# Altium schematic sheet 10.SchDoc
size 297 x 209 mm
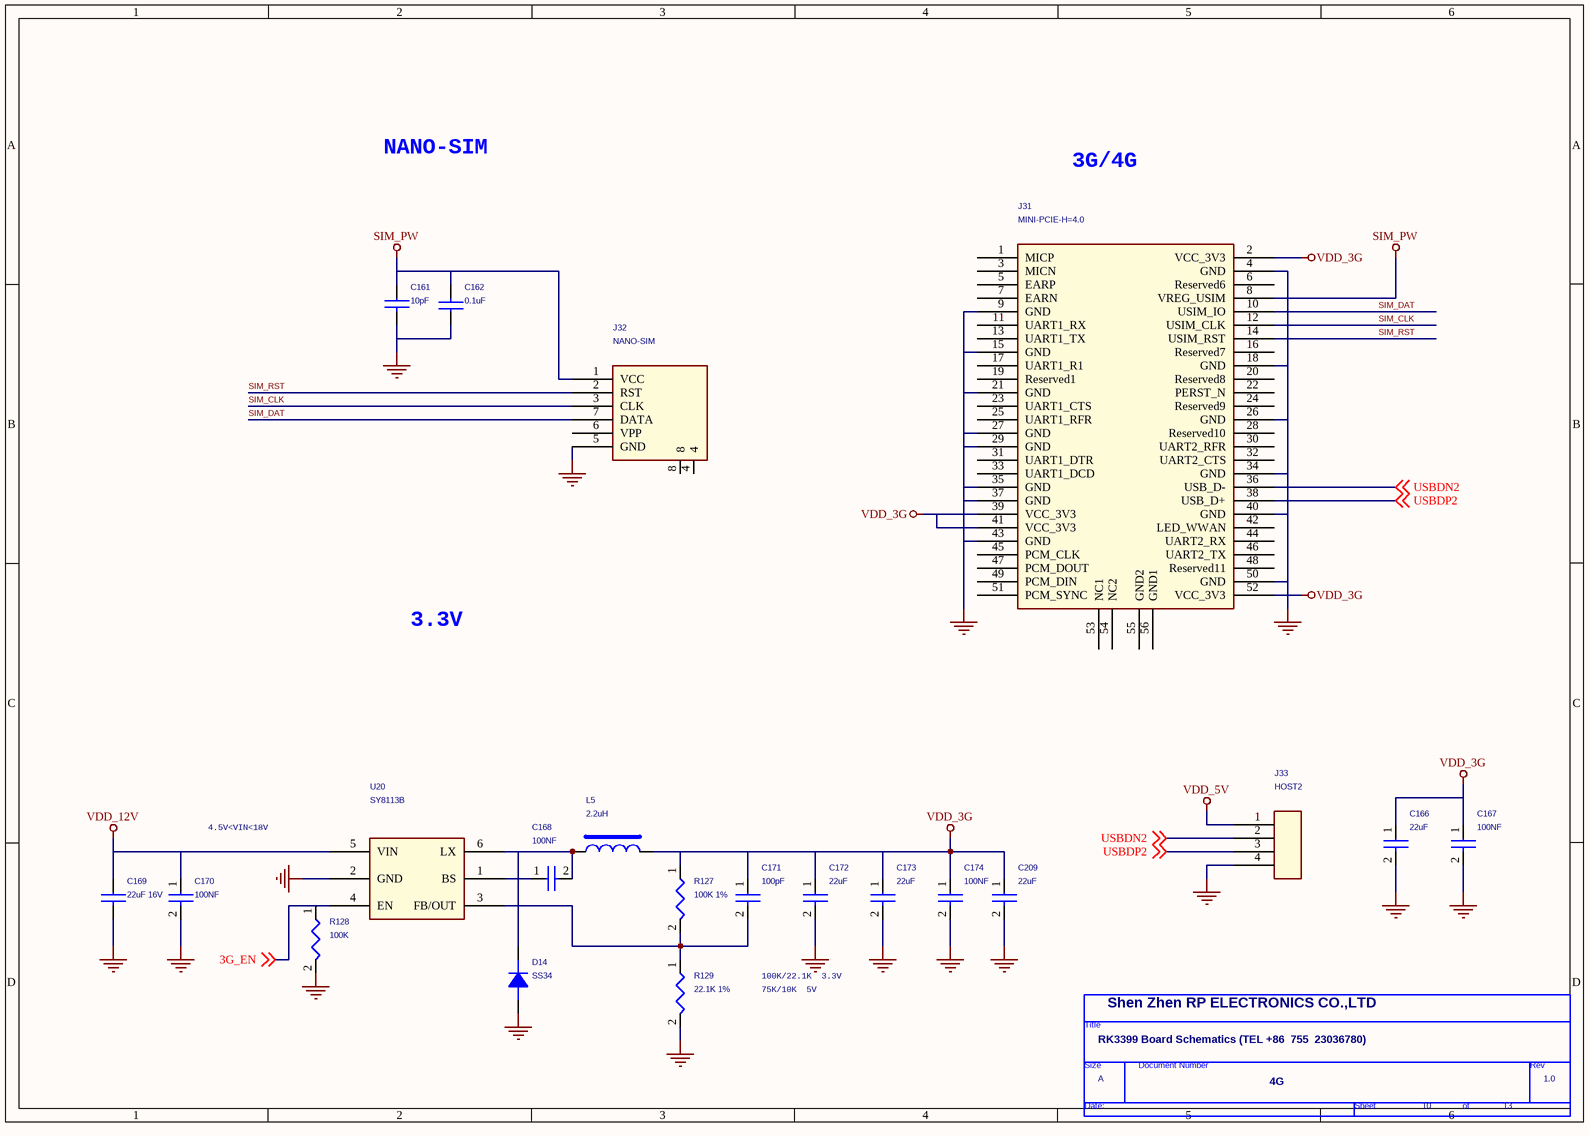
[diagram p0: 10.SchDoc]

## Parts
*  Doc: 4G  RevCode: 1.0  Title: RK3399 Board Schematics (TEL +86  755  23036780)  Page Size: A  Page Number: 10  Page Count: 13  Cage Code: Shen Zhen RP ELECTRONICS CO.,LTD  (hidden comment: TitleBlock0)  (graphical)
C161  10pF  [0402_CC]
C162  0.1uF  [0402_CC]
C166  22uF  [0603_cc]
C167  100NF  [0402_cc]
C168  100NF  [0402_cc]
C169  22uF 16V  [C0805]
C170  100NF  [0402_cc]
C171  100pF  [0402_cc]
C172  22uF  [0603_cc]
C173  22uF  [0603_cc]
C174  100NF  [0402_cc]
C209  22uF  [0603_cc]
D14  SS34  [DO-214AC]
J31  MINI-PCIE-H=4.0  [mini-pcie-smd]
J32  NANO-SIM  [SIM_1]
J33  HOST2  [sip-4p-2d0]
L5  2.2uH  [l5d18]
R127  100K 1%  [R0402]
R128  100K  [R0402]
R129  22.1K 1%  [R0402]
U20  SY8113B  [SOT23-6]

## Nets
GND: C161.2 C162.1 C166.2 C167.2 C169.2 C170.2 C172.2 C173.2 C174.2 C209.2 D14.1(A) J31.4(GND) J31.9(GND) J31.15(GND) J31.18(GND) J31.21(GND) J31.26(GND) J31.27(GND) J31.29(GND) J31.34(GND) J31.35(GND) J31.37(GND) J31.40(GND) J31.43(GND) J31.50(GND) J32.5(GND) J33.4 R128.2 R129.2 U20.2(GND)
SIM_PW: C161.1 C162.2 J31.8(VREG_USIM) J32.1(VCC)
VDD_3G: C166.1 C167.1 C171.1 C172.1 C173.1 C174.1 C209.1 J31.2(VCC_3V3) J31.39(VCC_3V3) J31.41(VCC_3V3) J31.52(VCC_3V3) L5.2 R127.1
VDD_5V: J33.1
VDD_12V: C169.1 C170.1 U20.5(VIN)
3G_EN: R128.1 U20.4(EN) ; off-sheet 3G_EN
SIM_CLK: J31.12(USIM_CLK) J32.3(CLK)
SIM_DAT: J31.10(USIM_IO) J32.7(DATA)
SIM_RST: J31.14(USIM_RST) J32.2(RST)
USBDN2: J31.36(USB_D-) J33.2 ; off-sheet USBDN2
USBDP2: J31.38(USB_D+) J33.3 ; off-sheet USBDP2
NetC168_1: C168.1 U20.1(BS)
NetC168_2: C168.2 D14.2(K) L5.1 U20.6(LX)
NetC171_2: C171.2 R127.2 R129.1 U20.3(FB/OUT)

Not connected (* = marked no-connect by the designer): J31 1(MICP) 3(MICN) 5(EARP) 6(Reserved6) 7(EARN) 11(UART1_RX) 13(UART1_TX) 16(Reserved7) 17(UART1_R1) 19(Reserved1) 20(Reserved8) 22(PERST_N) 23(UART1_CTS) 24(Reserved9) 25(UART1_RFR) 28(Reserved10) 30(UART2_RFR) 31(UART1_DTR) 32(UART2_CTS) 33(UART1_DCD) 42(LED_WWAN) 44(UART2_RX) 45(PCM_CLK) 46(UART2_TX) 47(PCM_DOUT) 48(Reserved11) 49(PCM_DIN) 51(PCM_SYNC) 53(NC1) 54(NC2) 55(GND2) 56(GND1); J32 4 6(VPP) 8

## Notes on the sheet
- NANO-SIM
- 3G/4G
- 3.3V
- 4.5V<VIN<18V
- 100K/22.1K  3.3V
- 75K/10K  5V
- (in symbol TitleBlock0) Title; Size; Document Number; Rev; Date:; Sheet; of

## Library data of the parts
C161 C162 C169 = CAP NP_Dup8
C166 = CAP NP_Dup2: cap,10.00uF,+/-10%,10V,X5R,C0805; Manufacturer: TDK; RK PN: C2012X5R1A106K125AB; Priority: A; Tolerance: 10%; Voltage: 10V; Dielectric: X5R; Part Type: C0805; Manufacturer PN: C2012X5R1A106K125AB; Created by: JJJ
C167 = CAP NP_Dup2: cap,100.00nF,+/-10%,16V,X5R,C0402; Manufacturer: TDK; RK PN: C1005X5R1C104K050BA; Priority: A; Tolerance: 10%; Voltage: 16V; Dielectric: X5R; Part Type: C0402; Manufacturer PN: C1005X5R1C104K050BA; Created by: JJJ
C168 = CAP NP_Dup2: cap,100.00nF,+/-10%,25V,X5R,C0402; Manufacturer: TDK; RK PN: C1005X5R1E104K050BC; Priority: A; Tolerance: 10%; Voltage: 25V; Dielectric: X5R; Part Type: C0402; Manufacturer PN: C1005X5R1E104K050BC; Created by: JJJ
C170 = CAP NP_Dup2: cap,100.00nF,+/-10%,25V,X5R,C0402; Manufacturer PN: C1005X5R1E104K050BC; Manufacturer: TDK; Tolerance: 10%; Priority: A; Voltage: 25V; Dielectric: X5R; Created by: JJJ; Part Type: C0402; RK PN: C1005X5R1E104K050BC
C171 = CAP NP_Dup2: cap,100.00pF,+/-5%,50V,C0G,C0402; Manufacturer PN: C1005C0G1H101J050BA; Manufacturer: TDK; Tolerance: 5%; Priority: A; Voltage: 50V; Dielectric: C0G; Created by: JJJ; Part Type: C0402; RK PN: C1005C0G1H101J050BA
C172 C209 = CAP NP_Dup2: cap,22.00uF,+/-10%,10V,X5R,C0805; Manufacturer PN: C2012X5R1A226K125AB; Manufacturer: TDK; Tolerance: 10%; Priority: A; Voltage: 10V; Dielectric: X5R; Created by: JJJ; Part Type: C0805; RK PN: C2012X5R1A226K125AB
C173 = CAP NP_Dup2: cap,10.00uF,+/-10%,10V,X5R,C0805; Manufacturer PN: C2012X5R1A106K125AB; Manufacturer: TDK; Tolerance: 10%; Priority: A; Voltage: 10V; Dielectric: X5R; Created by: JJJ; Part Type: C0805; RK PN: C2012X5R1A106K125AB
C174 = CAP NP_Dup2: cap,100.00nF,+/-10%,16V,X5R,C0402; Manufacturer PN: C1005X5R1C104K050BA; Manufacturer: TDK; Tolerance: 10%; Priority: A; Voltage: 16V; Dielectric: X5R; Created by: JJJ; Part Type: C0402; RK PN: C1005X5R1C104K050BA
D14 = DIODE_Dup1
J31 = EM770_2
J32 = SIM_0
J33 = CON4
L5 = INDUCTORS OF FERRITE: Power Inductor,3.3uH,0.2,IND_404030; Manufacturer PN: SWPA4030S3R3MT; Manufacturer: sunlord; DC Resistor: 0.04ohm; Isat: 3.3A; Resonace frequency: 38M; Irms: 2.4A; Tolerance: 20%; Priority: A; Created by: YTL; Part Type: POWER_IND; RK PN: SWPA4030S3R3MT
R127 = RESISTOR_Dup1: 通用厚膜电阻,75K,+/-1%,R0402,1/16W.; Manufacturer: YAGEO; RK PN: RC0402FR-0775KL; Priority: A; Wattage: 1/16W; Tolerance: 1%; Part Type: 通用厚膜电阻; Manufacturer PN: RC0402FR-0775KL; Created by: YTL
R128 = RESISTOR_Dup1: 通用厚膜电阻,10K,+/-1%,R0402,1/16W.; Manufacturer: YAGEO; Tolerance: 1%; RK PN: RC0402FR-0710KL; Priority: A; Wattage: 1/16W; Part Type: 通用厚膜电阻; Manufacturer PN: RC0402FR-0710KL; Created by: YTL
R129 = RESISTOR_Dup1: 通用厚膜电阻,10K,+/-1%,R0402,1/16W.; Manufacturer PN: RC0402FR-0710KL; Manufacturer: YAGEO; Wattage: 1/16W; Priority: A; Tolerance: 1%; Created by: YTL; Part Type: 通用厚膜电阻; RK PN: RC0402FR-0710KL
U20 = DCDC_SY8113: Manufacturer: Silergy（矽力杰）; Priority: A; Created by: JJJ; Manufacturer PN: SY8113B; Part Type: DCDC; RK PN: SY8113B
* = TitleBlock0: Page Create Date: March  8, 1995